# Altium schematic sheet SimpleAstableMultivibrator.SchDoc
size 431 x 279 mm; SheetNumber: 1; SheetTotal: 1; ENG_APP_DATE: --/--/--; DSN_APP_DATE: --/--/--; CHK_APP_DATE: --/--/--
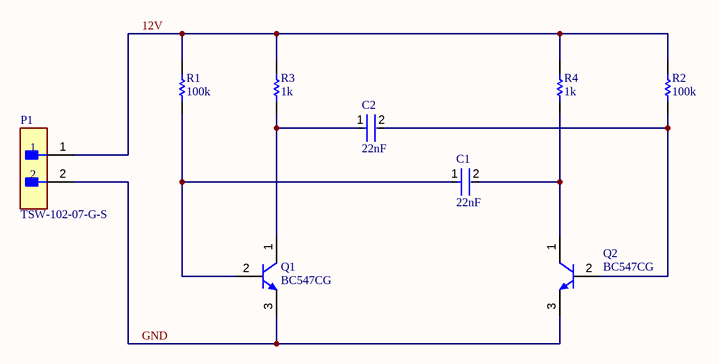
[diagram p0: SimpleAstableMultivibrator.SchDoc]

## Parts
C1  value 22nF  [FP-C0603C-CF-IPC_A]  (hidden comment: Capacitor 22nF +/-5% 16V 0603)
C2  value 22nF  [FP-C0603C-CF-IPC_A]  (hidden comment: Capacitor 22nF +/-5% 16V 0603)
P1  TSW-102-07-G-S  [FP-TSW-102-07-G-S-MFG]
Q1  BC547CG  [ONSC-TO-92-3-29-11]
Q2  BC547CG  [ONSC-TO-92-3-29-11]
R1  value 100k  [RESC2013X70X40ML20T20]  (hidden comment: Resistor 100K +/-5% 0805 125 mW)
R2  value 100k  [RESC2013X70X40ML20T20]  (hidden comment: Resistor 100K +/-5% 0805 125 mW)
R3  value 1k  [RESC2013X70X40ML20T20]  (hidden comment: Resistor 1K +/-5% 0805 500 mW)
R4  value 1k  [RESC2013X70X40ML20T20]  (hidden comment: Resistor 1K +/-5% 0805 500 mW)

## Nets
12V: P1.1 R1.1 R2.1 R3.1 R4.1
GND: P1.2 Q1.3(E) Q2.3(E)
NetC1_1: C1.1 Q1.2(B) R1.2
NetC1_2: C1.2 Q2.1(C) R4.2
NetC2_1: C2.1 Q1.1(C) R3.2
NetC2_2: C2.2 Q2.2(B) R2.2

## Notes on the sheet
- DWG. NO.
- REV.
- SHT.
- THIS DOCUMENT AND THE DATA DISCLOSED HEREIN OR HEREWITH IS THE PROPERTY OF ALTIUM LIMITED AND MAY BE FREELY DISTRIBUTED IN WHOLE. NO RIGHTS ARE RESERVED OR EXPRESS OR IMPLIED WARANTEE GIVEN.
- REVISION
- DESCRIPTION
- DATE
- APPROVED
- ENG:
- APPROVALS
- PROJECT
- DSN:
- CHK:
- REFERENCE DOCUMENTS
- PROJECT REVISION:
- TITLE
- DOCUMENT REVISION:
- DESIGN ITEM:
- BOM:
- FAB DWG:
- PCB DWG:
- ASSY DWG:
- SCALE:
- SIZE
- B
- CAGE CODE
- FILE NAME
- DWG NO.
- SHEET
- OF
- REV

## Library data of the parts
C1 C2 = CMP-001-00083-2: Ceramic Capacitor, Multilayer, Ceramic, 16V, 5% +Tol, 5% -Tol, X7R, 15% TC, 0.022uF, Surface Mount, 0603; Multilayer: Yes; Height: 0.8mm; Terminal Finish: Nickel; Mounting Technology: Surface Mount; Pins: 2; Rated DC Voltage (URdc): 16V; Max Operating Temperature: 125°C; Packaging: Tape and Reel; Tolerance (fill in as +-): 5%; Dielectric Material: Ceramic; Reach SVHC Compliant: Yes; Capacitor Type: Ceramic; Width: 0.8mm; Length: 1.6mm; Termination: Wraparound; JESD-609 Code: e3; Tolerance  (fill in as +-): 5%; RoHS Compliant: Yes; Package Style: SMTMeter; Case/Package: 0603; Temperature Characteristics Code: X7R; Package Shape: Rectangular; Min Operating Temperature: -55°C
P1 = CMP-002-00071-1: Board Connector, 2 Contact(s), 1 Row(s), Male, Straight, 0.1 inch Pitch, Solder Terminal, Black Insulator; Plating Thickness: 10uin; IEC Conformance: No; Number Of PCB Rows: 1; Number of Contacts: 2; Contact Pattern: RECTANGULAR; Contact Style: SQ PIN-SKT; Additional Feature: E.L.P.; Mating Information: MULTIPLE MATING PARTS AVAILABLE; Body/Shell Style: RECEPTACLE; Reference Standard: UL; Option: General Purpose; Reliability: COMMERCIAL; Mounting Style: STRAIGHT; Contact Material: Bronze; Reach SVHC Compliant: Yes; Terminal Pitch: 2.54mm; Insulation Material: Glass; Body Breadth: 0.1inch; Connector Type: BOARD CONNECTOR; Mating Contact Pitch: 0.1inch; Mounting Technology: Board; Number Of Connectors: 1; Mixed Contacts: No; Filter Feature: No; Contact Finish - Termination: Gold (Au) - with Nickel (Ni) barrier; Termination: Solder; Contact Finish - Mating: GOLD (10) OVER NICKEL (50); RoHS Compliant: Yes; PCB Contact Pattern: RECTANGULAR; MIL Conformance: No; Terminal Length: 0.1inch; Flammability Rating: UL94 V-0; Insulation Color: Black; Number of Rows Loaded: 1; DIN Conformance: No; Body Depth: 0.1inch; Contact Gender: Male; JESD-609 Code: e4
Q1 Q2 = CMP-013-00035-1: Small Signal Bipolar Transistor, 0.1A I(C), 45V V(BR)CEO, 1-Element, NPN, Silicon, TO-92; Max Collector Current: 100mA; DC Current Gain-Min (hFE): 420; Number of Elements: 1; Package Body Material: Plastic; Surface Mount: No; Transistor Application: AMPLIFIER; Frequency: 300MHz; Qualification Status: Not Qualified; Power Dissipation-Max (Abs): 625mW; Time @ Peak Reflow Temperature-Max (s): 40s; Polarity/Channel Type: NPN; JEDEC-95 Code: TO-92; Peak Reflow Temperature (Cel): 260°C; Package Style: CYLINDRICALMeter; JESD-609 Code: e1; Terminal Finish: Copper; Collector-emitter Voltage-Max: 45V; JESD-30 Code: O-PBCY-T3; Reach SVHC Compliant: Yes; Transistor Element Material: SILICON; Max Operating Temperature: 150°C; Pins: 3; RoHS Compliant: Yes; Terminal Form: Through Hole; Package Shape: Round; Terminal Position: BOTTOM
R1 R2 = CMP-009-00177-1: Fixed Resistor, Metal Glaze/thick Film, 0.125W, 100000ohm, 150V, 5% +/-Tol, 200ppm/Cel, Surface Mount, 0805; Package Width: 1.25mm; Temperature Coefficient (ppm/Cel): 200; Power: 125mW; Package Height: 0.6mm; Package Length: 2mm; Reference Standard: AEC-Q200; Rated Temperature: 70°C; Mounting Technology: Surface Mount; Package Shape: Rectangular; Pins: 2; Tolerance: 5%; Max Operating Temperature: 155°C; Min Operating Temperature: -55°C; Construction: Rectangular; Working Voltage: 150V; Resistor Type: FIXED RESISTOR; JESD-609 Code: e3; Technology: METAL GLAZE/THICK FILM; Reach SVHC Compliant: Yes; Terminal Finish: Nickel; RoHS Compliant: Yes; Termination: Wraparound; Case/Package: 0805; Packaging: Tape and Reel
R3 R4 = CMP-009-00178-1: Fixed Resistor, Metal Glaze/thick Film, 0.5W, 1000ohm, 400V, 5% +/-Tol, 200ppm/Cel, Surface Mount, 0805; Package Length: 2mm; Reference Standard: AEC-Q200; Package Height: 0.6mm; Rated Temperature: 70°C; Power: 500mW; Temperature Coefficient (ppm/Cel): 200; Package Width: 1.25mm; Pins: 2; Max Operating Temperature: 155°C; Technology: METAL GLAZE/THICK FILM; RoHS Compliant: Yes; Min Operating Temperature: -55°C; Termination: Wraparound; JESD-609 Code: e3; Mounting Technology: Surface Mount; Construction: Rectangular; Resistor Type: FIXED RESISTOR; Terminal Finish: Tin; Tolerance: 5%; Packaging: Tape and Reel; Case/Package: 0805; Reach SVHC Compliant: Yes; Package Shape: Rectangular; Working Voltage: 400V